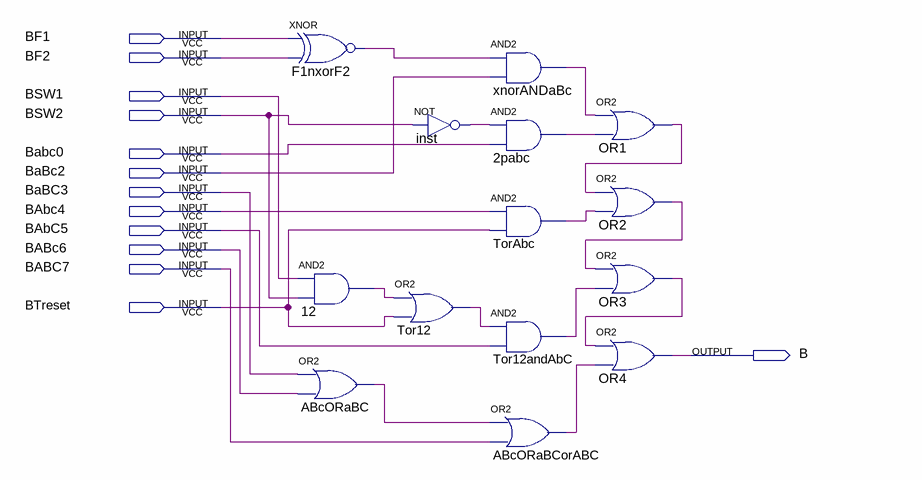
[diagram p0: schematic sheet]
// Quartus schematic B.bdf as structural Verilog: 14 symbols, 13 pins
module B (
  input  BF1,
  input  BF2,
  input  BSW1,
  input  BSW2,
  input  Babc0,
  input  BaBc2,
  input  BaBC3,
  input  BAbc4,
  input  BAbC5,
  input  BABc6,
  input  BABC7,
  input  BTreset,
  output B
);

  wire ABcORaBC_out, ABcORaBCorABC_out, F1nxorF2_out, inst_out, n2pabc_out, n12_out, OR1_out, OR2_out,
       OR3_out, Tor12_out, Tor12andAbC_out, TorAbc_out, xnorANDaBc_out;

  xnor F1nxorF2 (F1nxorF2_out, BF1, BF2);
  and u_12 (n12_out, BSW1, BSW2);
  or ABcORaBC (ABcORaBC_out, BaBC3, BABc6);
  not inst (inst_out, BSW2);
  or Tor12 (Tor12_out, n12_out, BTreset);
  and xnorANDaBc (xnorANDaBc_out, F1nxorF2_out, BaBc2);
  and u_2pabc (n2pabc_out, inst_out, Babc0);
  and TorAbc (TorAbc_out, BAbc4, BTreset);
  and Tor12andAbC (Tor12andAbC_out, Tor12_out, BAbC5);
  or ABcORaBCorABC (ABcORaBCorABC_out, ABcORaBC_out, BABC7);
  or OR1 (OR1_out, xnorANDaBc_out, n2pabc_out);
  or OR2 (OR2_out, OR1_out, TorAbc_out);
  or OR3 (OR3_out, OR2_out, Tor12andAbC_out);
  or OR4 (B, OR3_out, ABcORaBCorABC_out);
endmodule
